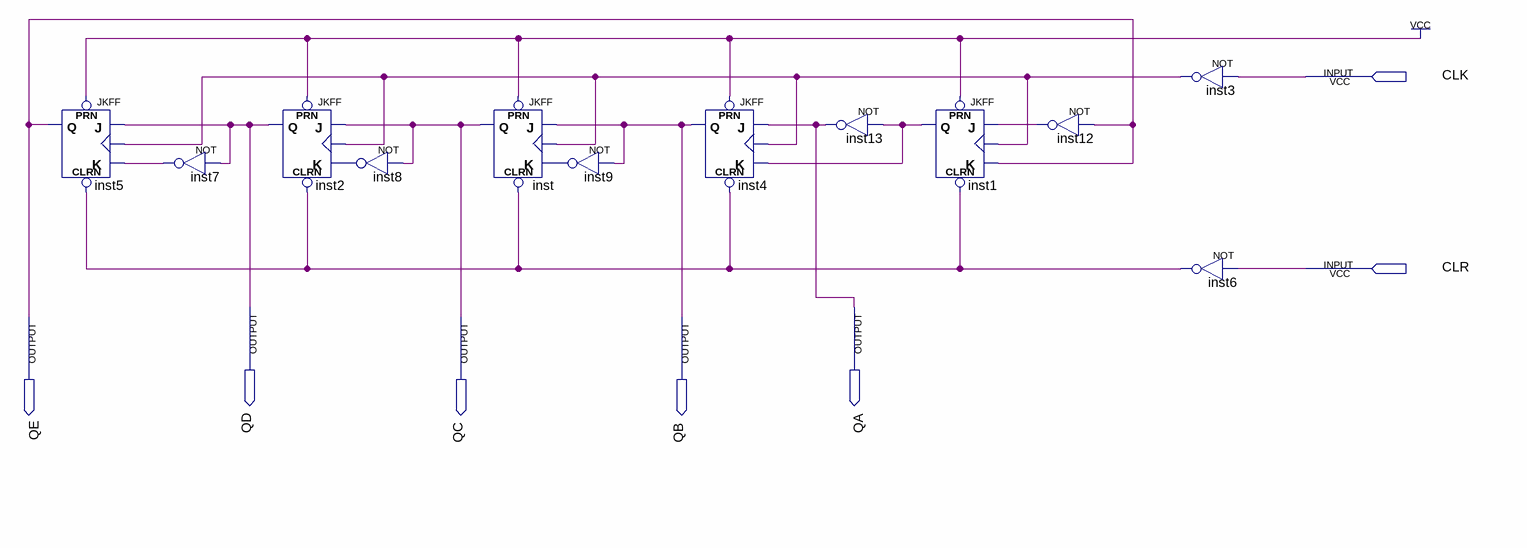
[diagram p0: schematic sheet]
// Quartus schematic ContadorEmAnel.bdf as structural Verilog: 12 symbols, 7 pins
module ContadorEmAnel (
  input  CLK,
  input  CLR,
  output QD,
  output QA,
  output QE,
  output QC,
  output QB
);

  wire inst1_q, inst3_out, inst6_out, inst7_out, inst8_out, inst9_out, inst12_out;

  JKFF inst5 (.PRN(1'b1), .CLRN(inst6_out), .K(inst7_out), .J(QD), .CLK(inst3_out), .Q(QE));
  not inst7 (inst7_out, QD);
  JKFF inst2 (.PRN(1'b1), .CLRN(inst6_out), .K(inst8_out), .J(QC), .CLK(inst3_out), .Q(QD));
  not inst8 (inst8_out, QC);
  JKFF inst (.PRN(1'b1), .CLRN(inst6_out), .K(inst9_out), .J(QB), .CLK(inst3_out), .Q(QC));
  not inst9 (inst9_out, QB);
  JKFF inst4 (.PRN(1'b1), .CLRN(inst6_out), .K(inst1_q), .J(QA), .CLK(inst3_out), .Q(QB));
  not inst13 (QA, inst1_q);
  JKFF inst1 (.PRN(1'b1), .CLRN(inst6_out), .K(QE), .J(inst12_out), .CLK(inst3_out), .Q(inst1_q));
  not inst12 (inst12_out, QE);
  not inst3 (inst3_out, CLK);
  not inst6 (inst6_out, CLR);
endmodule
